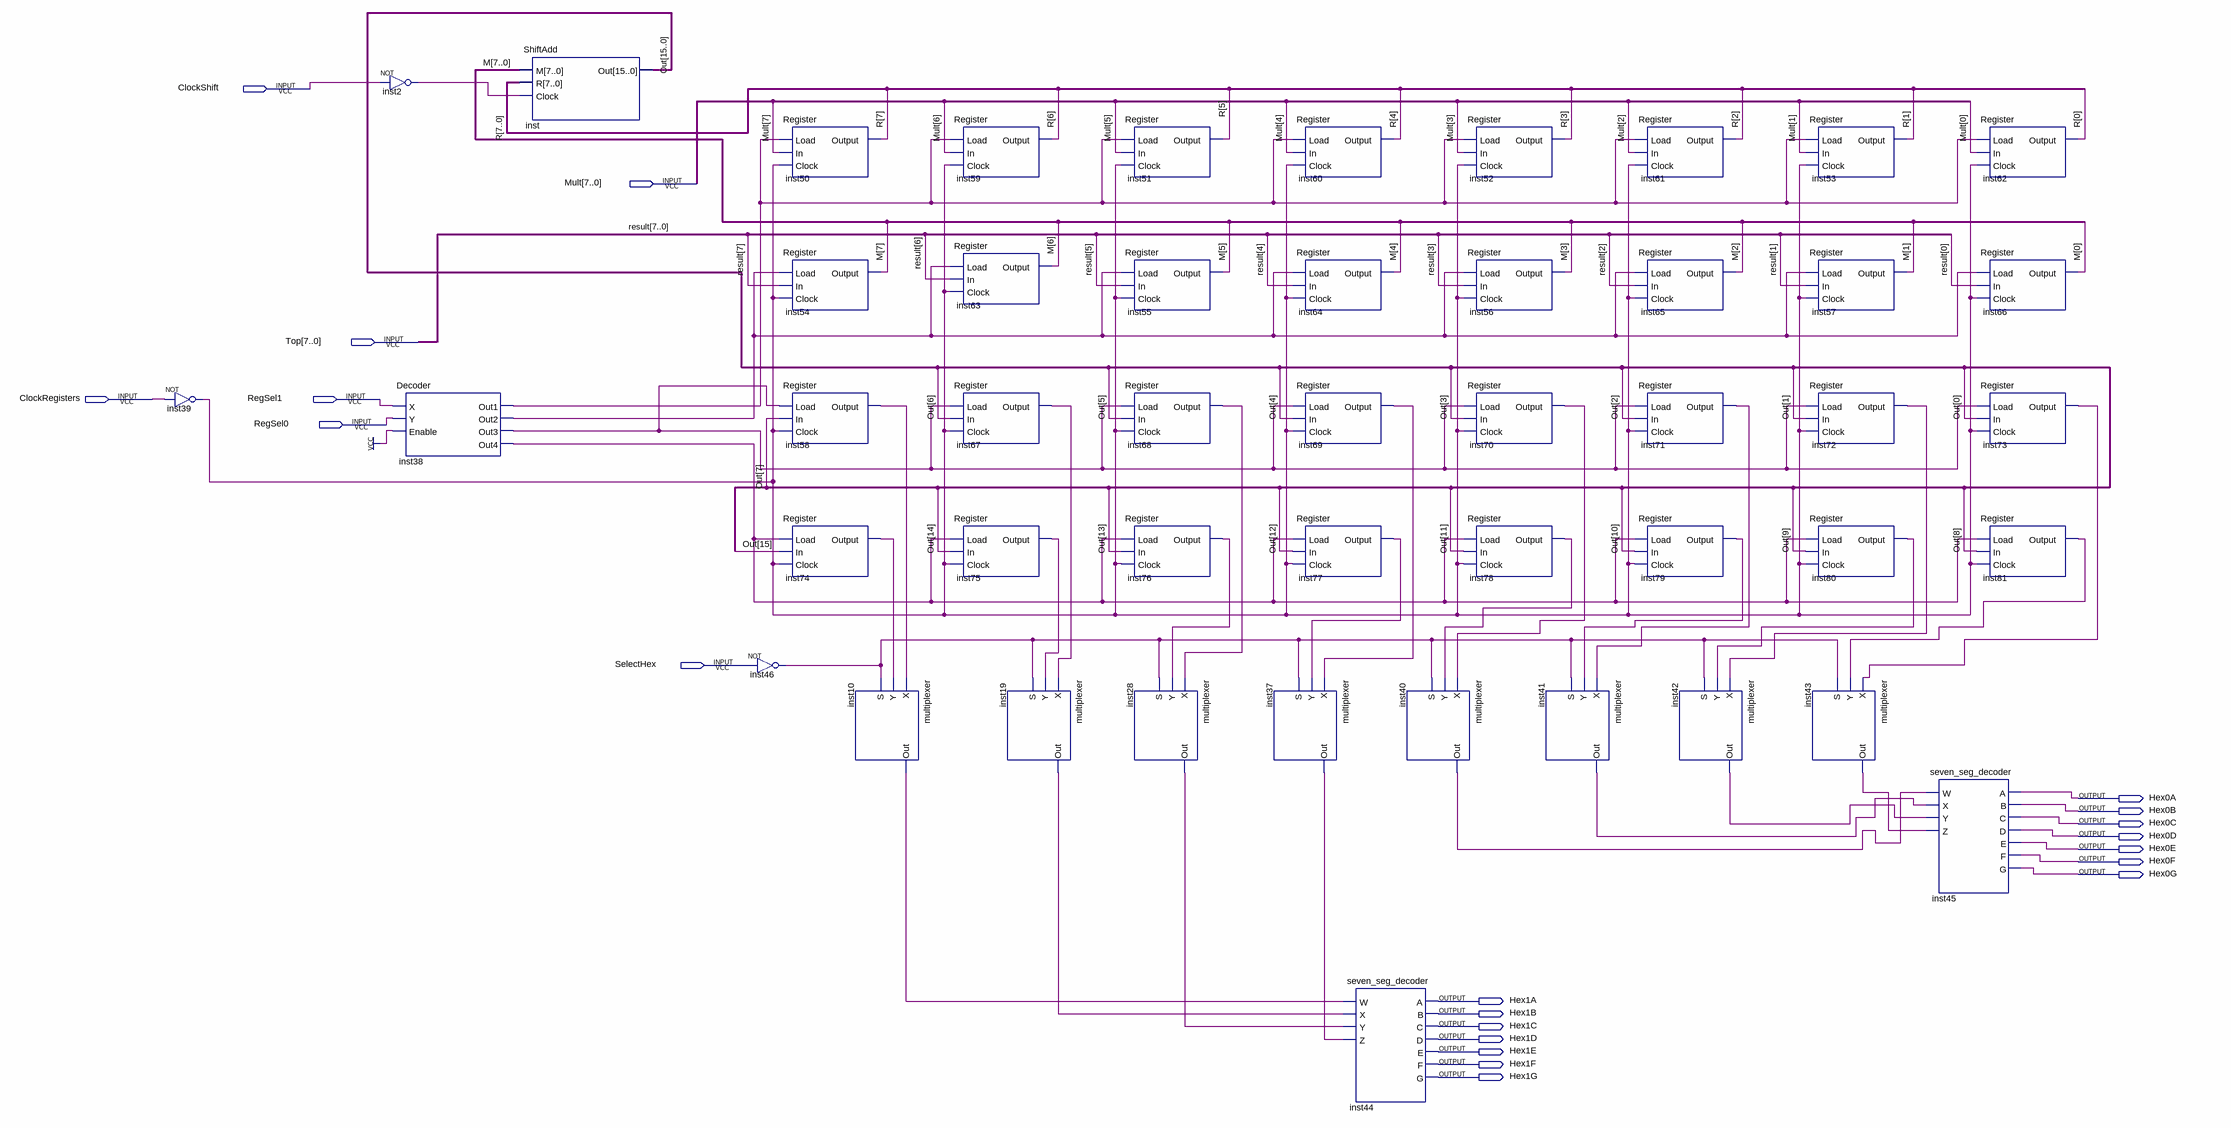
[diagram p0: schematic sheet]
// Quartus schematic Multiplier.bdf as structural Verilog: 47 symbols, 21 pins
module Multiplier (
  input  ClockShift,
  input  [7:0] Mult,
  input  [7:0] Top,
  input  ClockRegisters,
  input  RegSel1,
  input  RegSel0,
  input  SelectHex,
  output Hex0A,
  output Hex0B,
  output Hex0C,
  output Hex0D,
  output Hex0E,
  output Hex0F,
  output Hex0G,
  output Hex1A,
  output Hex1B,
  output Hex1C,
  output Hex1D,
  output Hex1E,
  output Hex1F,
  output Hex1G
);

  wire inst2_out, inst10_out, inst19_out, inst28_out, inst37_out, inst38_out1, inst38_out2, inst38_out3,
       inst38_out4, inst39_out, inst40_out, inst41_out, inst42_out, inst43_out, inst46_out, inst58_output,
       inst67_output, inst68_output, inst69_output, inst70_output, inst71_output, inst72_output,
       inst73_output, inst74_output, inst75_output, inst76_output, inst77_output, inst78_output,
       inst79_output, inst80_output, inst81_output;
  wire [7:0] M, R;
  wire [15:0] Out;

  not inst39 (inst39_out, ClockRegisters);
  not inst2 (inst2_out, ClockShift);
  Decoder inst38 (
    .X(RegSel1), .Y(RegSel0), .Enable(1'b1), .Out1(inst38_out1), .Out2(inst38_out2), .Out3(inst38_out3),
    .Out4(inst38_out4));
  ShiftAdd inst (.M(M), .R(R), .Clock(inst2_out), .Out(Out));
  Register inst50 (.Load(inst38_out1), .In(Mult[7]), .Clock(inst39_out), .Output(R[7]));
  Register inst54 (.Load(inst38_out2), .In(Top[7]), .Clock(inst39_out), .Output(M[7]));
  Register inst58 (.Load(inst38_out3), .In(Out[7]), .Clock(inst39_out), .Output(inst58_output));
  Register inst74 (.Load(inst38_out4), .In(Out[15]), .Clock(inst39_out), .Output(inst74_output));
  not inst46 (inst46_out, SelectHex);
  multiplexer inst10 (.X(inst58_output), .Y(inst74_output), .S(inst46_out), .Out(inst10_out));
  Register inst59 (.Load(inst38_out1), .In(Mult[6]), .Clock(inst39_out), .Output(R[6]));
  Register inst63 (.Load(inst38_out2), .In(Top[6]), .Clock(inst39_out), .Output(M[6]));
  Register inst67 (.Load(inst38_out3), .In(Out[6]), .Clock(inst39_out), .Output(inst67_output));
  Register inst75 (.Load(inst38_out4), .In(Out[14]), .Clock(inst39_out), .Output(inst75_output));
  multiplexer inst19 (.X(inst67_output), .Y(inst75_output), .S(inst46_out), .Out(inst19_out));
  Register inst51 (.Load(inst38_out1), .In(Mult[5]), .Clock(inst39_out), .Output(R[5]));
  Register inst55 (.Load(inst38_out2), .In(Top[5]), .Clock(inst39_out), .Output(M[5]));
  Register inst68 (.Load(inst38_out3), .In(Out[5]), .Clock(inst39_out), .Output(inst68_output));
  Register inst76 (.Load(inst38_out4), .In(Out[13]), .Clock(inst39_out), .Output(inst76_output));
  multiplexer inst28 (.X(inst68_output), .Y(inst76_output), .S(inst46_out), .Out(inst28_out));
  multiplexer inst37 (.X(inst69_output), .Y(inst77_output), .S(inst46_out), .Out(inst37_out));
  Register inst60 (.Load(inst38_out1), .In(Mult[4]), .Clock(inst39_out), .Output(R[4]));
  Register inst64 (.Load(inst38_out2), .In(Top[4]), .Clock(inst39_out), .Output(M[4]));
  Register inst69 (.Load(inst38_out3), .In(Out[4]), .Clock(inst39_out), .Output(inst69_output));
  Register inst77 (.Load(inst38_out4), .In(Out[12]), .Clock(inst39_out), .Output(inst77_output));
  seven_seg_decoder inst44 (
    .W(inst10_out), .X(inst19_out), .Y(inst28_out), .Z(inst37_out), .A(Hex1A), .B(Hex1B), .C(Hex1C),
    .D(Hex1D), .E(Hex1E), .F(Hex1F), .G(Hex1G));
  multiplexer inst40 (.X(inst70_output), .Y(inst78_output), .S(inst46_out), .Out(inst40_out));
  Register inst52 (.Load(inst38_out1), .In(Mult[3]), .Clock(inst39_out), .Output(R[3]));
  Register inst56 (.Load(inst38_out2), .In(Top[3]), .Clock(inst39_out), .Output(M[3]));
  Register inst70 (.Load(inst38_out3), .In(Out[3]), .Clock(inst39_out), .Output(inst70_output));
  Register inst78 (.Load(inst38_out4), .In(Out[11]), .Clock(inst39_out), .Output(inst78_output));
  multiplexer inst41 (.X(inst71_output), .Y(inst79_output), .S(inst46_out), .Out(inst41_out));
  Register inst61 (.Load(inst38_out1), .In(Mult[2]), .Clock(inst39_out), .Output(R[2]));
  Register inst65 (.Load(inst38_out2), .In(Top[2]), .Clock(inst39_out), .Output(M[2]));
  Register inst71 (.Load(inst38_out3), .In(Out[2]), .Clock(inst39_out), .Output(inst71_output));
  Register inst79 (.Load(inst38_out4), .In(Out[10]), .Clock(inst39_out), .Output(inst79_output));
  multiplexer inst42 (.X(inst72_output), .Y(inst80_output), .S(inst46_out), .Out(inst42_out));
  Register inst53 (.Load(inst38_out1), .In(Mult[1]), .Clock(inst39_out), .Output(R[1]));
  Register inst57 (.Load(inst38_out2), .In(Top[1]), .Clock(inst39_out), .Output(M[1]));
  Register inst72 (.Load(inst38_out3), .In(Out[1]), .Clock(inst39_out), .Output(inst72_output));
  Register inst80 (.Load(inst38_out4), .In(Out[9]), .Clock(inst39_out), .Output(inst80_output));
  multiplexer inst43 (.X(inst73_output), .Y(inst81_output), .S(inst46_out), .Out(inst43_out));
  seven_seg_decoder inst45 (
    .W(inst40_out), .X(inst41_out), .Y(inst42_out), .Z(inst43_out), .A(Hex0A), .B(Hex0B), .C(Hex0C),
    .D(Hex0D), .E(Hex0E), .F(Hex0F), .G(Hex0G));
  Register inst62 (.Load(inst38_out1), .In(Mult[0]), .Clock(inst39_out), .Output(R[0]));
  Register inst66 (.Load(inst38_out2), .In(Top[0]), .Clock(inst39_out), .Output(M[0]));
  Register inst73 (.Load(inst38_out3), .In(Out[0]), .Clock(inst39_out), .Output(inst73_output));
  Register inst81 (.Load(inst38_out4), .In(Out[8]), .Clock(inst39_out), .Output(inst81_output));

  // Other names for the same wires on the sheet: result[7:0] = Top
endmodule
